# Altium schematic sheet Speaker LM4818.SchDoc
size 209 x 297 mm; Author: Мурашкин Д.В.; Address1: Address1; Address2: Address2; Address3: Address3; Address4: Address4; DocumentNumber: SS19946-01; Scale: 1:1; Letter1Column: Э; PartName: Контроллер батареи
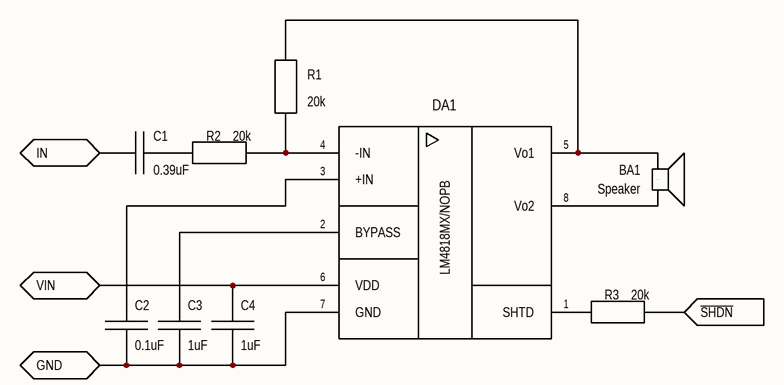
[diagram p0: Speaker LM4818.SchDoc]

## Parts
BA1  Speaker  [Speaker wires]
C1  0.39uF  [CAPC1608L]
C2  0.1uF  [CAPC1608L]
C3  1uF  [CAPC1608L]
C4  1uF  [CAPC1608L]
DA1  LM4818MX/NOPB  [SOIC-8]
R1  20k  [RESC1608L]
R2  20k  [RESC1608L]
R3  20k  [RESC1608L]

## Ports
GND, IN, VIN, ~{SHDN} (in)

## Nets
GND: C2.2 C3.2 C4.2 DA1.7(GND) ; port GND
IN: C1.1 ; port IN
~{SHDN}: R3.2 ; port ~{SHDN}
VIN: C4.1 DA1.6(VDD) ; port VIN
NetBA1_1: BA1.1(+) DA1.5(Vo1) R1.1
NetBA1_2: BA1.2(-) DA1.8(Vo2)
NetC1_2: C1.2 R2.1
NetC2_1: C2.1 DA1.3(+IN)
NetC3_1: C3.1 DA1.2(BYPASS)
NetDA1_1: DA1.1(SHTD) R3.1
NetDA1_4: DA1.4(-IN) R1.2 R2.2

## Notes on the sheet
- Перв. примен.
- Справ. №
- Подп. и дата
- Инв. № дубл.
- Взам. инв. №
- Разраб.
- Изм.
- Лист
- № докум.
- Подп.
- Дата
- Лит.
- Масса
- Масштаб
- Пров.
- Т.контр.
- Листов
- Инв. № подл.
- Утв.
- Н.контр.
- 2.106-A4
- Копировал
- Формат А4

## Library data of the parts
BA1 = Speaker wires: Group: Speakers; Part name: Speaker
C1 = Capacitor Ceramic 0.39uF 10V 0603(1608): Group: Ceramic Capacitors; Temperature Coefficient: X7R; Tolerance: ±10%; Type: Ceramic; Voltage: 10V; Package: 0603 (1608); Value: 0.39uF
C2 = Capacitor Ceramic 0.1uF 25V 0603(1608): Group: Ceramic Capacitors; Temperature Coefficient: X7R; Tolerance: ±10%; Type: Ceramic; Voltage: 25V; Package: 0603 (1608); Value: 0.1uF
C3 C4 = Capacitor Ceramic 1uF 25V 0603(1608): Group: Ceramic Capacitors; Temperature Coefficient: X5R; Tolerance: ±10%; Short description: CAP CER 1UF 25V X5R 0603; Type: Ceramic; Voltage: 25V; Package: 0603 (1608); Value: 1uF
DA1 = LM4818MX/NOPB: Audio Power Amplifier with Shutdown  Mode; Manufacturer: Texas Instruments; Group: Linear - Amplifiers - Audio; Part name: LM4818MX/NOPB; Package: SOIC-8
R1-R3 = Resistor Ceramic 20k 0.1W 0603(1608)_1: Resistor Ceramic 20k 0.1W 0603(1608); Group: Resistors; Temperature Coefficient: ±100ppm/°C; Tolerance: ±5%; Type: Thin Film; Power: 0.1W; Package: 0603 (1608); Value: 20k